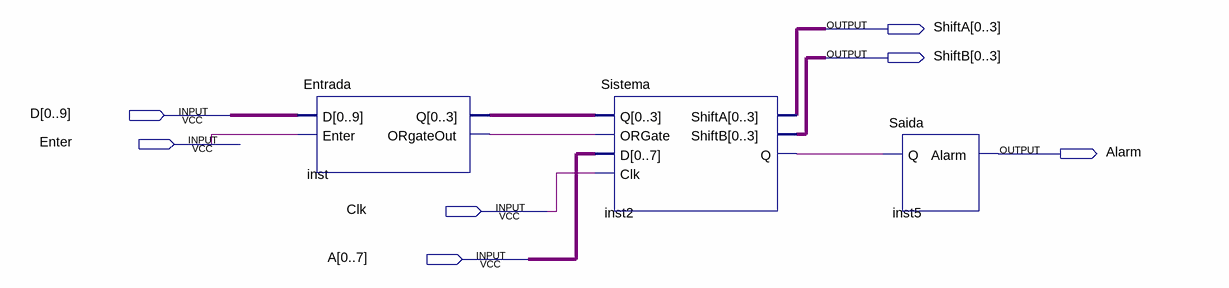
[diagram p0: schematic sheet]
// Quartus schematic SistemaCompleto.bdf as structural Verilog: 3 symbols, 7 pins
module SistemaCompleto (
  input  [0:9] D,
  input  Enter,
  input  Clk,
  input  [0:7] A,
  output [0:3] ShiftA,
  output [0:3] ShiftB,
  output Alarm
);

  wire inst2_q, inst_orgateout;
  wire [3:0] inst_q;

  Entrada inst (.D(D), .Enter(Enter), .Q(inst_q), .ORgateOut(inst_orgateout));
  Sistema inst2 (
    .Q({inst_q[0], inst_q[1], inst_q[2], inst_q[3], inst2_q}), .ORGate(inst_orgateout), .D(A), .Clk(Clk),
    .ShiftA(ShiftA), .ShiftB(ShiftB));
  Saida inst5 (.Q(inst2_q), .Alarm(Alarm));
endmodule
